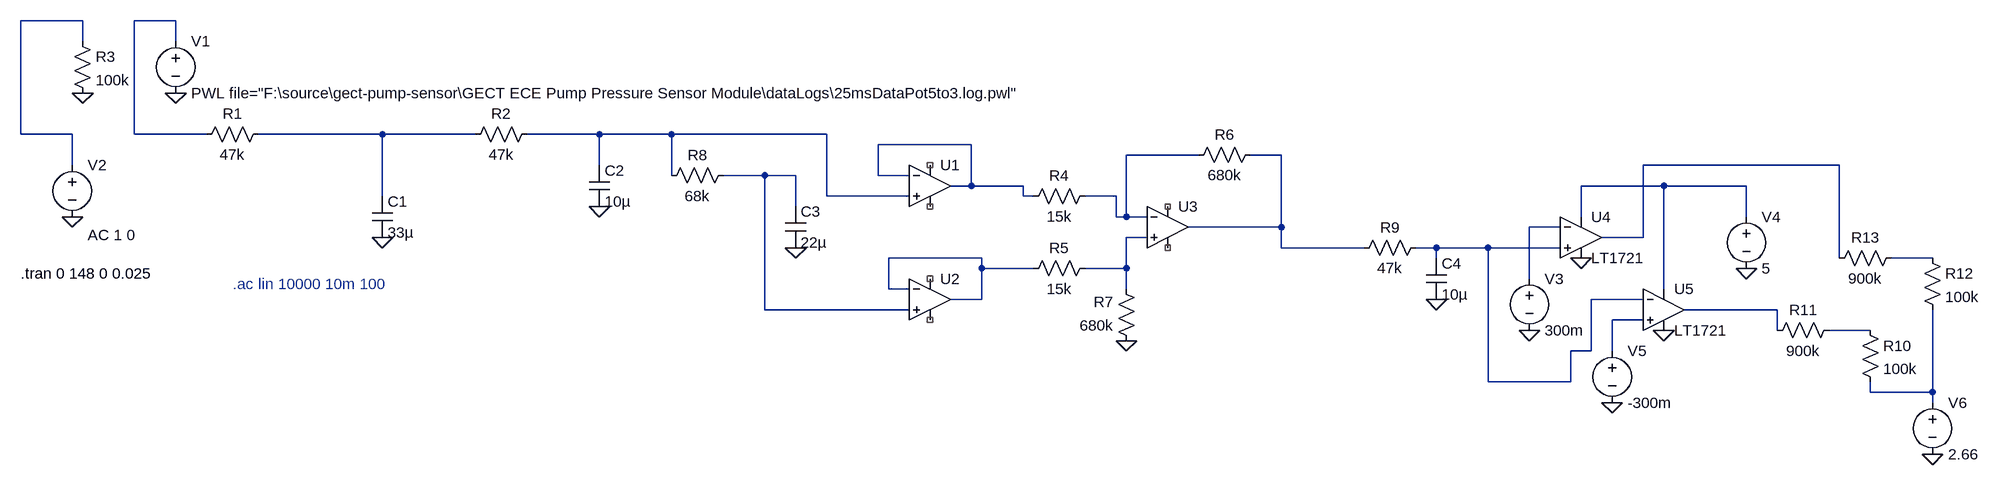
[diagram p0: schematic RC sim.asc]
RC sim.asc, the LTspice schematic file:
Version 4
SHEET 1 3104 772
WIRE 160 -176 64 -176
WIRE 304 -176 240 -176
WIRE 160 -144 160 -176
WIRE 304 -144 304 -176
WIRE 64 0 64 -176
WIRE 144 0 64 0
WIRE 240 0 240 -176
WIRE 352 0 240 0
WIRE 624 0 432 0
WIRE 768 0 624 0
WIRE 960 0 848 0
WIRE 1072 0 960 0
WIRE 1312 0 1072 0
WIRE 1536 16 1392 16
WIRE 1888 32 1776 32
WIRE 2016 32 1968 32
WIRE 144 48 144 0
WIRE 960 48 960 0
WIRE 2880 48 2576 48
WIRE 1072 64 1072 0
WIRE 1216 64 1152 64
WIRE 1264 64 1216 64
WIRE 1392 64 1392 16
WIRE 1440 64 1392 64
WIRE 1536 80 1536 16
WIRE 1536 80 1504 80
WIRE 1616 80 1536 80
WIRE 2608 80 2480 80
WIRE 2736 80 2608 80
WIRE 624 96 624 0
WIRE 1312 96 1312 0
WIRE 1440 96 1312 96
WIRE 1616 96 1616 80
WIRE 1632 96 1616 96
WIRE 1760 96 1712 96
WIRE 1264 112 1264 64
WIRE 1760 128 1760 96
WIRE 1776 128 1776 32
WIRE 1776 128 1760 128
WIRE 1808 128 1776 128
WIRE 2480 128 2480 80
WIRE 2736 128 2736 80
WIRE 2016 144 2016 32
WIRE 2016 144 1872 144
WIRE 2448 144 2400 144
WIRE 1808 160 1776 160
WIRE 2576 160 2576 48
WIRE 2576 160 2512 160
WIRE 2016 176 2016 144
WIRE 2144 176 2016 176
WIRE 2256 176 2224 176
WIRE 2336 176 2256 176
WIRE 2448 176 2336 176
WIRE 1552 192 1408 192
WIRE 2256 192 2256 176
WIRE 2880 192 2880 48
WIRE 3024 192 2960 192
WIRE 1552 208 1552 192
WIRE 1632 208 1552 208
WIRE 1776 208 1776 160
WIRE 1776 208 1712 208
WIRE 2400 224 2400 144
WIRE 1408 240 1408 192
WIRE 1440 240 1408 240
WIRE 1776 240 1776 208
WIRE 2608 240 2608 80
WIRE 1552 256 1552 208
WIRE 1552 256 1504 256
WIRE 2576 256 2496 256
WIRE 1216 272 1216 64
WIRE 1440 272 1216 272
WIRE 2784 272 2640 272
WIRE 2576 288 2528 288
WIRE 2784 304 2784 272
WIRE 2928 304 2864 304
WIRE 2496 336 2496 256
WIRE 2496 336 2464 336
WIRE 2528 336 2528 288
WIRE 2336 384 2336 176
WIRE 2464 384 2464 336
WIRE 2464 384 2336 384
WIRE 2928 400 2928 384
WIRE 3024 400 3024 272
WIRE 3024 400 2928 400
WIRE 3024 416 3024 400
FLAG 304 -64 0
FLAG 624 160 0
FLAG 960 112 0
FLAG 144 128 0
FLAG 160 -64 0
FLAG 1776 320 0
FLAG 1264 176 0
FLAG 2400 304 0
FLAG 2736 208 0
FLAG 2480 192 0
FLAG 2528 416 0
FLAG 2608 304 0
FLAG 2256 256 0
FLAG 3024 496 0
SYMBOL voltage 304 -160 R0
WINDOW 123 0 0 Left 0
WINDOW 39 0 0 Left 0
SYMATTR InstName V1
SYMATTR Value PWL file="F:\source\gect-pump-sensor\GECT ECE Pump Pressure Sensor Module\dataLogs\25msDataPot5to3.log.pwl"
SYMBOL cap 608 96 R0
SYMATTR InstName C1
SYMATTR Value 33µ
SYMBOL res 448 -16 R90
WINDOW 0 0 56 VBottom 2
WINDOW 3 32 56 VTop 2
SYMATTR InstName R1
SYMATTR Value 47k
SYMBOL res 864 -16 R90
WINDOW 0 0 56 VBottom 2
WINDOW 3 32 56 VTop 2
SYMATTR InstName R2
SYMATTR Value 47k
SYMBOL cap 944 48 R0
SYMATTR InstName C2
SYMATTR Value 10µ
SYMBOL voltage 144 32 R0
WINDOW 123 24 124 Left 2
WINDOW 39 0 0 Left 0
SYMATTR Value2 AC 1 0
SYMATTR InstName V2
SYMATTR Value ""
SYMBOL res 144 -160 R0
SYMATTR InstName R3
SYMATTR Value 100k
SYMBOL OpAmps\\UniversalOpamp2 1472 80 R0
SYMATTR InstName U1
SYMATTR SpiceModel level.1
SYMBOL OpAmps\\UniversalOpamp2 1472 256 R0
SYMATTR InstName U2
SYMATTR SpiceModel level.1
SYMBOL OpAmps\\UniversalOpamp2 1840 144 R0
SYMATTR InstName U3
SYMATTR SpiceModel level.1
SYMBOL res 1728 80 R90
WINDOW 0 0 56 VBottom 2
WINDOW 3 32 56 VTop 2
SYMATTR InstName R4
SYMATTR Value 15k
SYMBOL res 1728 192 R90
WINDOW 0 0 56 VBottom 2
WINDOW 3 32 56 VTop 2
SYMATTR InstName R5
SYMATTR Value 15k
SYMBOL res 1984 16 R90
WINDOW 0 0 56 VBottom 2
WINDOW 3 32 56 VTop 2
SYMATTR InstName R6
SYMATTR Value 680k
SYMBOL res 1792 336 R180
WINDOW 0 36 76 Left 2
WINDOW 3 36 40 Left 2
SYMATTR InstName R7
SYMATTR Value 680k
SYMBOL res 1168 48 R90
WINDOW 0 0 56 VBottom 2
WINDOW 3 32 56 VTop 2
SYMATTR InstName R8
SYMATTR Value 68k
SYMBOL cap 1248 112 R0
SYMATTR InstName C3
SYMATTR Value 22µ
SYMBOL Comparators\\LT1721 2480 96 R0
SYMATTR InstName U4
SYMBOL voltage 2400 208 R0
WINDOW 123 0 0 Left 0
WINDOW 39 0 0 Left 0
SYMATTR InstName V3
SYMATTR Value 300m
SYMBOL voltage 2736 112 R0
WINDOW 123 0 0 Left 0
WINDOW 39 0 0 Left 0
SYMATTR InstName V4
SYMATTR Value 5
SYMBOL Comparators\\LT1721 2608 208 R0
SYMATTR InstName U5
SYMBOL voltage 2528 320 R0
WINDOW 123 0 0 Left 0
WINDOW 39 0 0 Left 0
SYMATTR InstName V5
SYMATTR Value -300m
SYMBOL res 2240 160 R90
WINDOW 0 0 56 VBottom 2
WINDOW 3 32 56 VTop 2
SYMATTR InstName R9
SYMATTR Value 47k
SYMBOL cap 2240 192 R0
SYMATTR InstName C4
SYMATTR Value 10µ
SYMBOL voltage 3024 400 R0
WINDOW 123 0 0 Left 0
WINDOW 39 0 0 Left 0
SYMATTR InstName V6
SYMATTR Value 2.66
SYMBOL res 2912 288 R0
SYMATTR InstName R10
SYMATTR Value 100k
SYMBOL res 2880 288 R90
WINDOW 0 0 56 VBottom 2
WINDOW 3 32 56 VTop 2
SYMATTR InstName R11
SYMATTR Value 900k
SYMBOL res 3008 176 R0
SYMATTR InstName R12
SYMATTR Value 100k
SYMBOL res 2976 176 R90
WINDOW 0 0 56 VBottom 2
WINDOW 3 32 56 VTop 2
SYMATTR InstName R13
SYMATTR Value 900k
TEXT 64 216 Left 2 !.tran 0 148 0 0.025
TEXT 392 232 Left 2 ;.ac lin 10000 10m 100

The netlist it stands for:
* RC sim.asc
V1 N002 0 PWL file="F:\source\gect-pump-sensor\GECT ECE Pump Pressure Sensor Module\dataLogs\25msDataPot5to3.log.pwl"
C1 N003 0 33µ
R1 N003 N002 47k
R2 N004 N003 47k
C2 N004 0 10µ
V2 N001 0 AC 1 0
R3 N001 0 100k
XU1 N004 N005 NC_01 NC_02 N005 level.1 Avol=1Meg GBW=10Meg Slew=10Meg ilimit=25m rail=0 Vos=0 phimargin=45 en=0 enk=0 in=0 ink=0 Rin=500Meg  ; pins IN+ IN- V+ V- OUT
XU2 N009 N014 NC_03 NC_04 N014 level.1 Avol=1Meg GBW=10Meg Slew=10Meg ilimit=25m rail=0 Vos=0 phimargin=45 en=0 enk=0 in=0 ink=0 Rin=500Meg  ; pins IN+ IN- V+ V- OUT
XU3 N012 N006 NC_05 NC_06 N007 level.1 Avol=1Meg GBW=10Meg Slew=10Meg ilimit=25m rail=0 Vos=0 phimargin=45 en=0 enk=0 in=0 ink=0 Rin=500Meg  ; pins IN+ IN- V+ V- OUT
R4 N006 N005 15k
R5 N012 N014 15k
R6 N007 N006 680k
R7 0 N012 680k
R8 N009 N004 68k
C3 N009 0 22µ
XU4 N013 N011 N010 0 N008 LT1720  ; LT1721, pins In+ In- V+ V- OUT
V3 N011 0 300m
V4 N010 0 5
XU5 N017 N013 N010 0 N016 LT1720  ; LT1721, pins In+ In- V+ V- OUT
V5 N017 0 -300m
R9 N013 N007 47k
C4 N013 0 10µ
V6 N019 0 2.66
R10 N018 N019 100k
R11 N018 N016 900k
R12 N015 N019 100k
R13 N015 N008 900k
.tran 0 148 0 0.025
* .ac lin 10000 10m 100
.lib UniversalOpamps2.sub
.lib LTC.lib
.backanno
.end